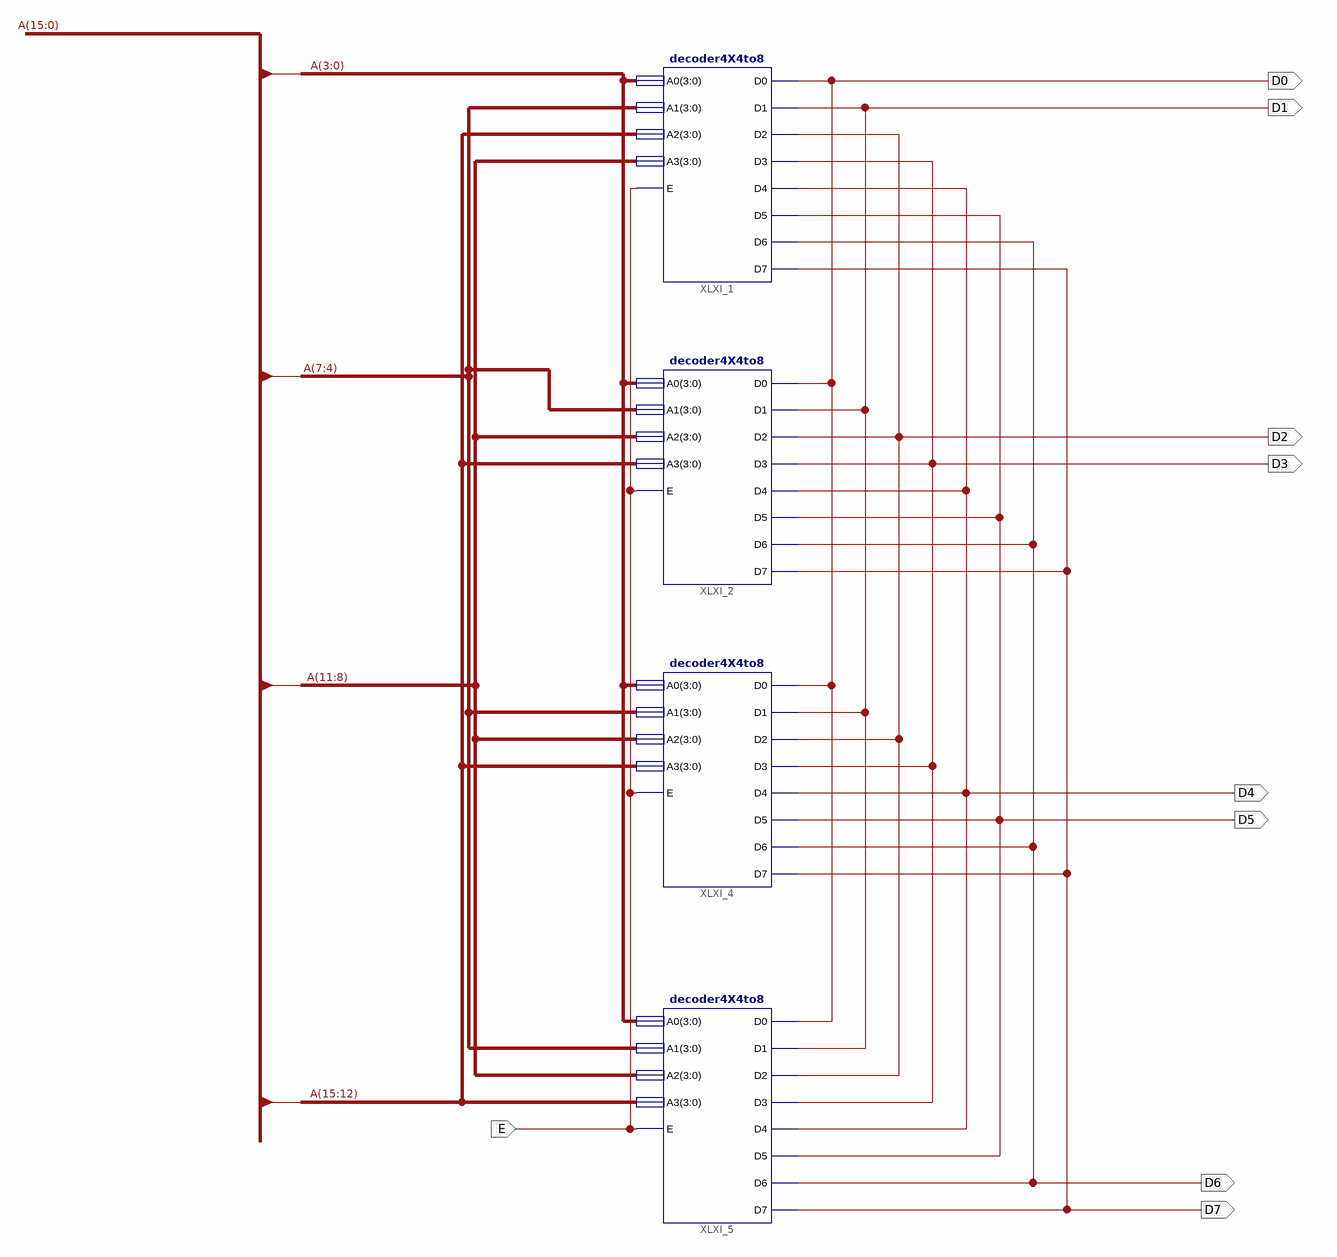
[diagram p0: schematic sheet 1]
// Xilinx ISE schematic decoder16bit4to8.sch (spartan3e) as structural Verilog: 4 symbols, 9 ports
module decoder16bit4to8 (
  input  E,
  output D0,
  output D1,
  output D2,
  output D3,
  output D4,
  output D5,
  output D6,
  output D7
);

  wire [15:0] A;

  decoder4X4to8 XLXI_1 (
    .A0(A[3:0]), .A1(A[7:4]), .A2(A[15:12]), .A3(A[11:8]), .D0(D0), .D1(D1), .D2(D2), .D3(D3), .D4(D4),
    .D5(D5), .D6(D6), .D7(D7), .E(E));
  decoder4X4to8 XLXI_2 (
    .A0(A[3:0]), .A1(A[7:4]), .A2(A[11:8]), .A3(A[15:12]), .D0(D0), .D1(D1), .D2(D2), .D3(D3), .D4(D4),
    .D5(D5), .D6(D6), .D7(D7), .E(E));
  decoder4X4to8 XLXI_4 (
    .A0(A[3:0]), .A1(A[7:4]), .A2(A[11:8]), .A3(A[15:12]), .D0(D0), .D1(D1), .D2(D2), .D3(D3), .D4(D4),
    .D5(D5), .D6(D6), .D7(D7), .E(E));
  decoder4X4to8 XLXI_5 (
    .A0(A[3:0]), .A1(A[7:4]), .A2(A[11:8]), .A3(A[15:12]), .D0(D0), .D1(D1), .D2(D2), .D3(D3), .D4(D4),
    .D5(D5), .D6(D6), .D7(D7), .E(E));
endmodule
